# EAGLE design multisonar_shield (EAGLE 9.6.0)
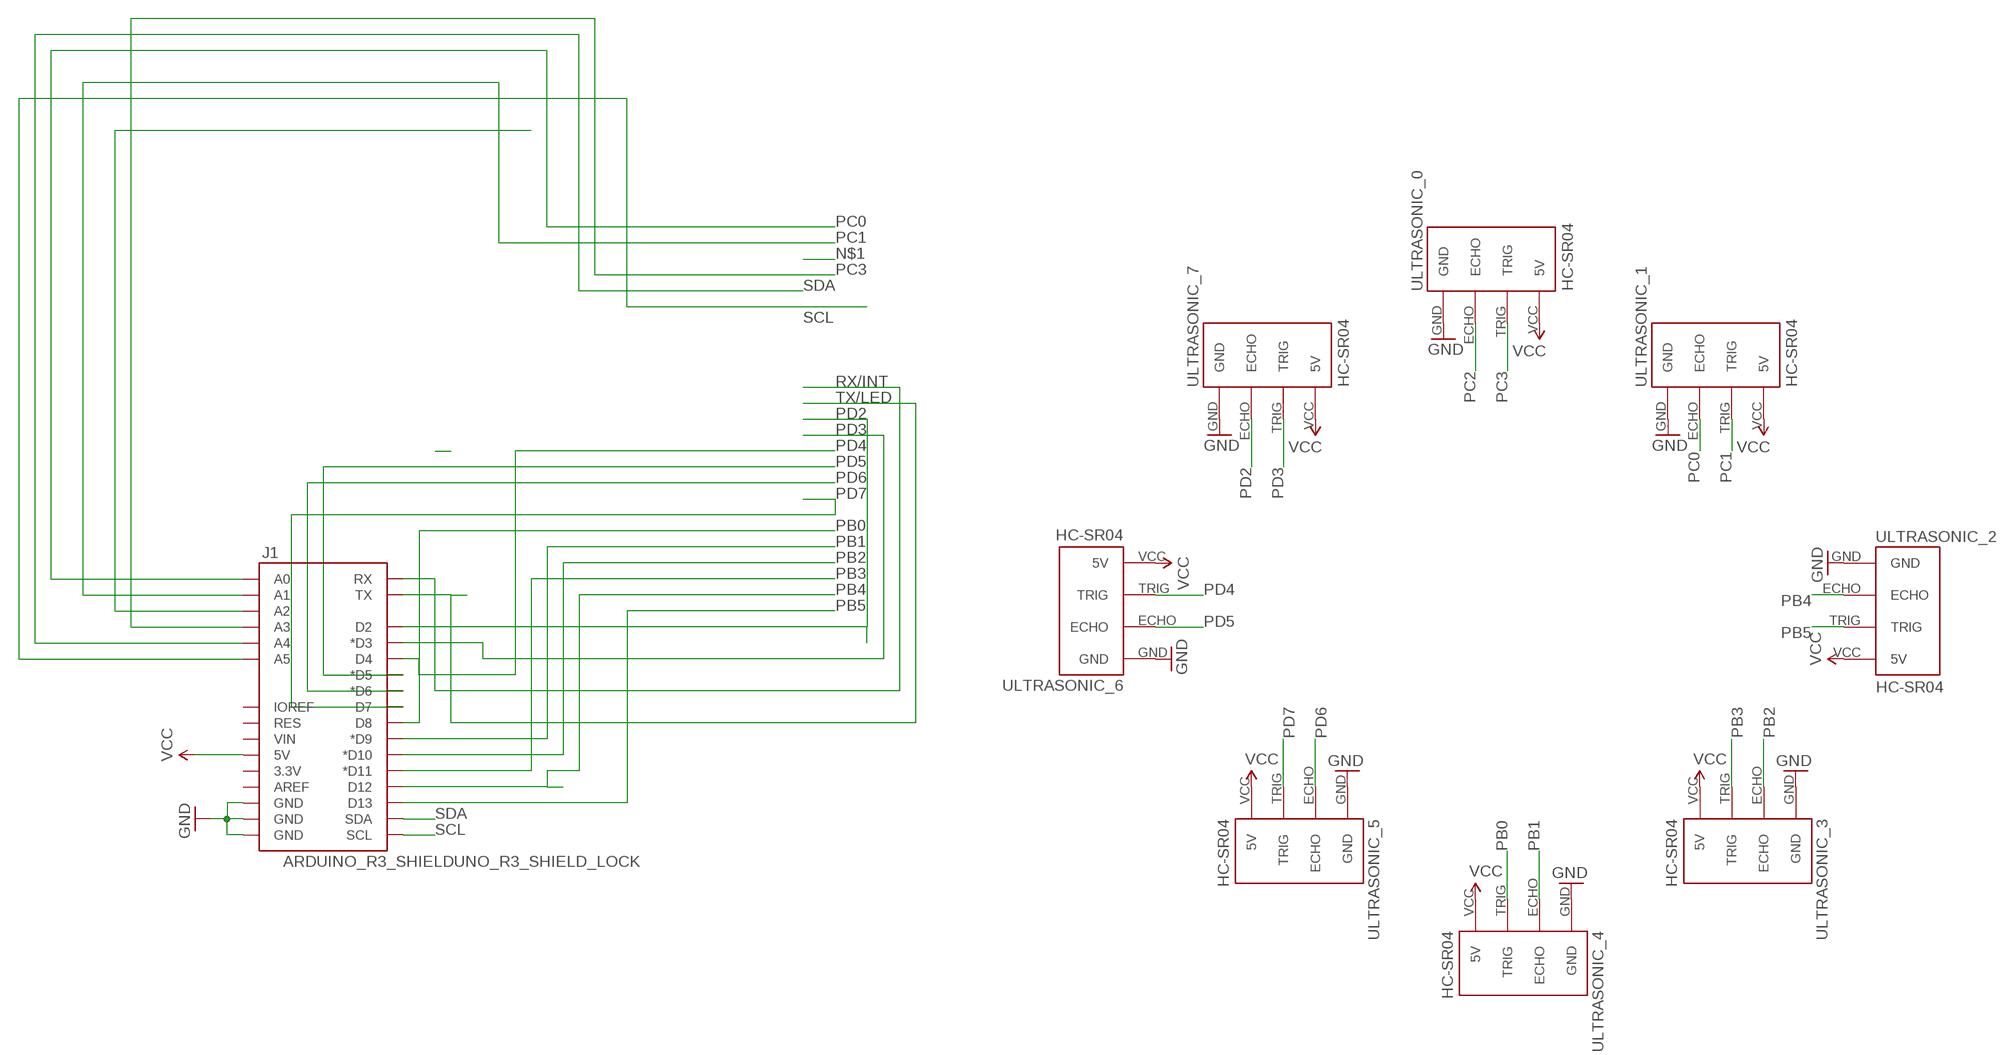
[diagram p0: schematic, sheet 1]

## Parts
J1  ARDUINO_R3_SHIELDUNO_R3_SHIELD_LOCK  [UNO_R3_SHIELD_LOCK]
ULTRASONIC_0  HC-SR04  [HC-SR04_FOOTPRINT]
ULTRASONIC_1  HC-SR04  [HC-SR04_FOOTPRINT]
ULTRASONIC_2  HC-SR04  [HC-SR04_FOOTPRINT]
ULTRASONIC_3  HC-SR04  [HC-SR04_FOOTPRINT]
ULTRASONIC_4  HC-SR04  [HC-SR04_FOOTPRINT]
ULTRASONIC_5  HC-SR04  [HC-SR04_FOOTPRINT]
ULTRASONIC_6  HC-SR04  [HC-SR04_FOOTPRINT]
ULTRASONIC_7  HC-SR04  [HC-SR04_FOOTPRINT]

## Nets
GND: J1.GND@0(GND) J1.GND@1(GND) J1.GND@2(GND) ULTRASONIC_0.GND ULTRASONIC_1.GND ULTRASONIC_2.GND ULTRASONIC_3.GND ULTRASONIC_4.GND ULTRASONIC_5.GND ULTRASONIC_6.GND ULTRASONIC_7.GND
PB0: J1.D8 ULTRASONIC_4.TRIG
PB1: J1.D9(*D9) ULTRASONIC_4.ECHO
PB2: J1.D10(*D10) ULTRASONIC_3.ECHO
PB3: J1.D11(*D11) ULTRASONIC_3.TRIG
PB4: J1.D12 ULTRASONIC_2.ECHO
PB5: J1.D13 ULTRASONIC_2.TRIG
PC0: J1.A0 ULTRASONIC_1.ECHO
PC1: J1.A1 ULTRASONIC_1.TRIG
PC2: J1.A2 ULTRASONIC_0.ECHO
PC3: J1.A3 ULTRASONIC_0.TRIG
PD2: J1.D2 ULTRASONIC_7.ECHO
PD3: J1.D3(*D3) ULTRASONIC_7.TRIG
PD4: J1.D4 ULTRASONIC_6.TRIG
PD5: J1.D5(*D5) ULTRASONIC_6.ECHO
PD6: J1.D6(*D6) ULTRASONIC_5.ECHO
PD7: J1.D7 ULTRASONIC_5.TRIG
RX/INT: J1.RX
SCL: J1.A5 J1.SCL
SDA: J1.A4 J1.SDA
TX/LED: J1.TX
VCC: J1.5V ULTRASONIC_0.VCC(5V) ULTRASONIC_1.VCC(5V) ULTRASONIC_2.VCC(5V) ULTRASONIC_3.VCC(5V) ULTRASONIC_4.VCC(5V) ULTRASONIC_5.VCC(5V) ULTRASONIC_6.VCC(5V) ULTRASONIC_7.VCC(5V)
Unconnected: J1.3.3V J1.AREF J1.IOREF J1.RES J1.VIN

## Library data of the parts
J1 = SparkFun-Boards:ARDUINO_R3_SHIELD: Shield form compatible with the Arduino Uno R3.
ULTRASONIC_0 ULTRASONIC_1-ULTRASONIC_7 = Ultrasonic Sensor HC-SR04:HC-SR04: Ultrasonic Sensor HC-SR04

## Board
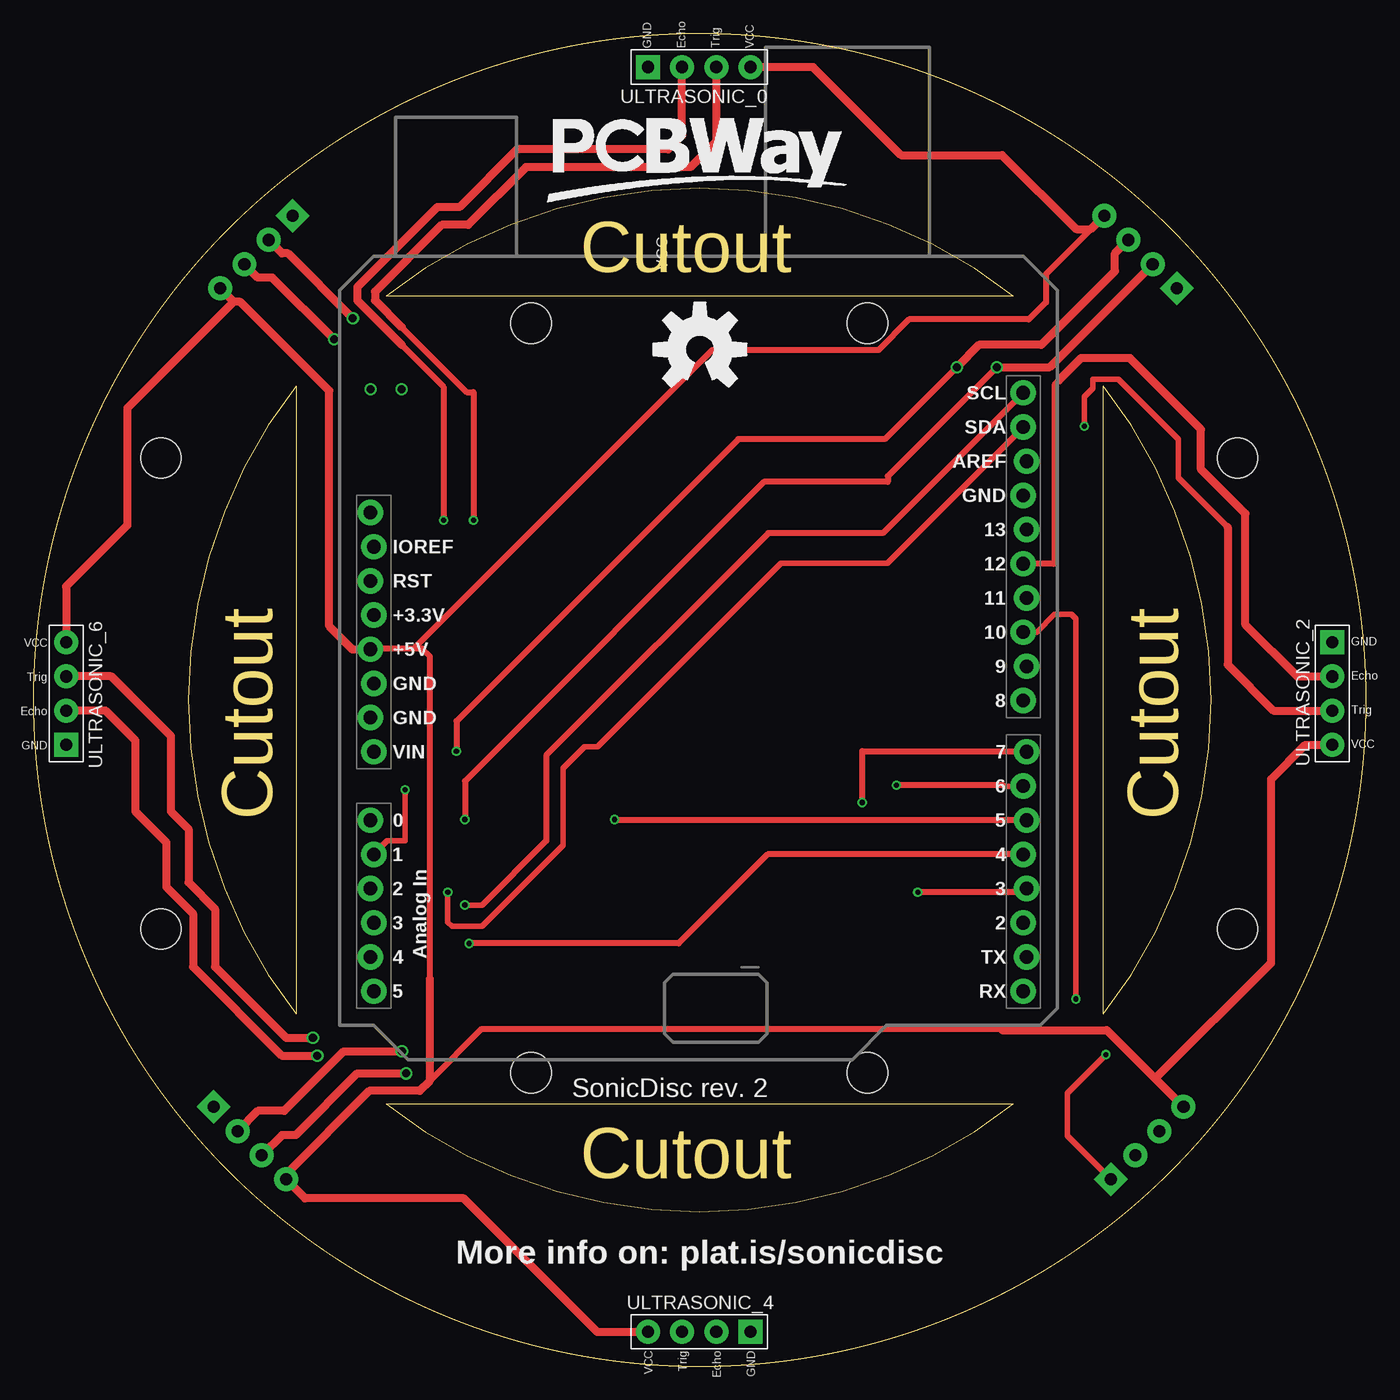
[diagram p1: board, top side]
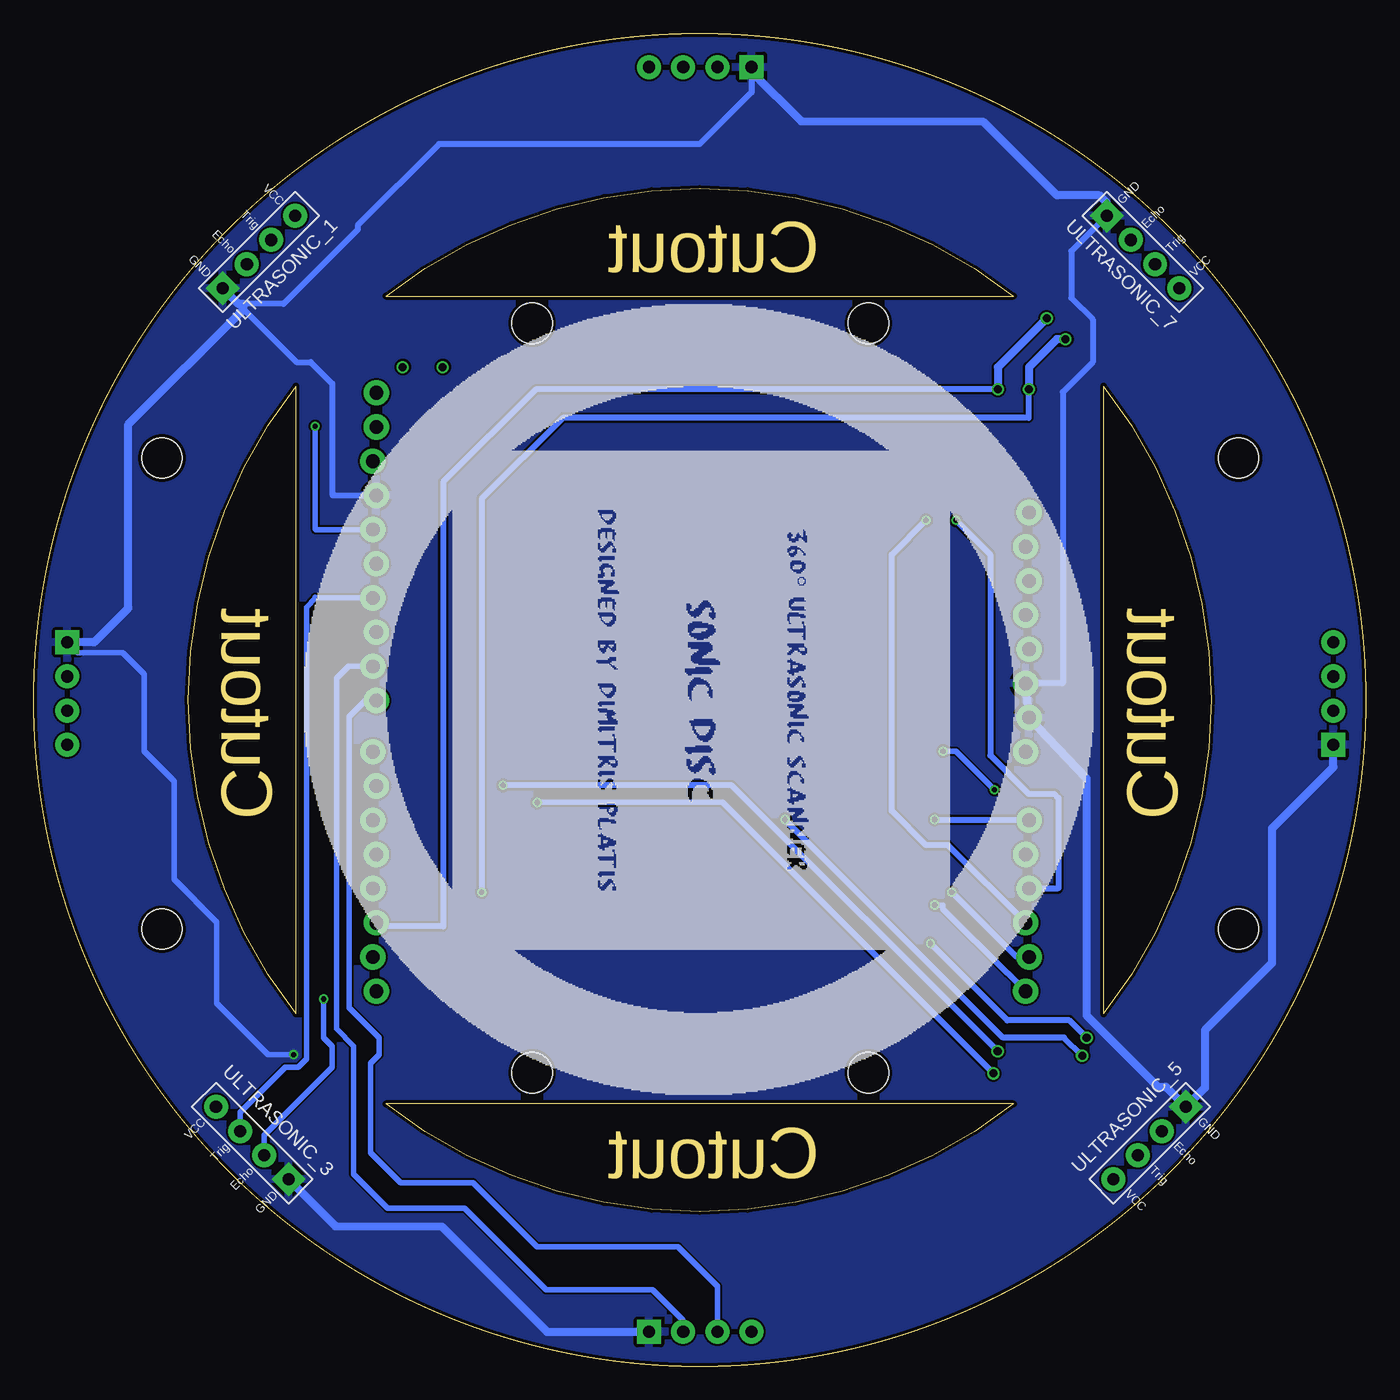
[diagram p2: board, bottom side, seen from below]

Size 99 x 99 mm. Coordinates in mm from the lower left corner, seen from the top.
Outline: 19.5,72.82 arc76 19.5,26.18 19.5,72.82
Outline: 26.18,19.5 72.82,19.5 arc-76 26.18,19.5
Outline: 79.5,26.18 79.5,72.82 arc-76 79.5,26.18
Outline: 72.82,79.5 arc76 26.18,79.5 72.82,79.5
Outline: circle at 49.5,49.5 radius 49.5
Copper layers (1*16): Top 0.035mm / dielectric 1.5mm / Bottom 0.035mm
Design rules "SeeedStudio_2layer_DRU_edited": minimum track width 7mil, minimum drill 15mil, track to track 6mil, track to pad 6mil, pad to pad 6mil, via to via 6mil, smd to smd 0mil, copper to edge 10mil, drill to drill 10mil, minimum pad ring 10mil, minimum via ring 6mil, stop-mask expansion 2mil, vias tented up to drill 100mil, thermal gap 10mil
Holes 3 mm at 36.96,77.48 36.96,21.81 61.96,21.81 61.96,77.48 9.46,32.48 89.46,32.48 89.46,67.48 9.46,67.48
Milling: 8 lines

### Footprints (pad centres in the part's own frame; a part is rotated, then mirrored left to right if it is on the bottom)
UNO_R3_SHIELD_LOCK = drill 1.016 pad 1.88: 3.3V 50.8,26.67; 5V 51.054,29.21; A0 51.054,41.91; A1 50.8,44.45; A2 51.054,46.99; A3 50.8,49.53; A4 51.054,52.07; A5 50.8,54.61; AREF 2.286,15.24; D2 2.54,49.53; D3 2.286,46.99; D4 2.54,44.45; D5 2.286,41.91; D6 2.54,39.37; D7 2.286,36.83; D8 2.54,33.02; D9 2.286,30.48; D10 2.54,27.94; D11 2.286,25.4; D12 2.54,22.86; D13 2.286,20.32; GND@0 50.8,31.75; GND@1 51.054,34.29; GND@2 2.54,17.78; IOREF 50.8,21.59; NC 51.054,19.05; RES 51.054,24.13; RX 2.54,54.61; SCL 2.54,10.16; SDA 2.54,12.7; TX 2.286,52.07; VIN 50.8,36.83
HC-SR04_FOOTPRINT = drill 0.9 pad 1.778: ECHO 2.54,1.27; TRIG 2.54,-1.27; VCC 2.54,-3.81 | drill 0.9 pad 1.778 square: GND 2.54,3.81

### Placement (x,y rotation side)
J1  76.08,82.48 180 top
U$1  [OSHW-LOGO-L]  49.51,75.54 0 top
ULTRASONIC_0  49.46,93.98 90 top
ULTRASONIC_1  80.46,80.98 135 bottom
ULTRASONIC_2  93.96,49.98 0 top
ULTRASONIC_3  80.96,18.38 225 bottom
ULTRASONIC_4  49.46,5.1 270 top
ULTRASONIC_5  17.86,18.38 315 bottom
ULTRASONIC_6  4.96,49.98 180 top
ULTRASONIC_7  18.36,80.98 45 bottom

### Tracks (layer width: path | path; a pad name or v marks a point on that pad's centre or on a via)
GND  (via drill 0.38)
  Top 0.406: ULTRASONIC_3.GND 76.81,17.13 76.81,20.3 v79.67,23.16
  Bottom 0.406: ULTRASONIC_2.GND 95.71,53 92.37,53 90.78,51.41 90.78,45.7 88.56,43.48 88.56,36.17 85.39,33 85.39,26.97 81.58,23.16 v79.67,23.16
  Bottom 0.457: ULTRASONIC_0.GND 45.65,94.65 49.51,90.78 68.88,90.78 74.91,84.75 74.91,84.44 80.42,78.92 83.79,78.92 | ULTRASONIC_1.GND 79.46,74.59 78.4,74.59 76.81,73 76.81,64.75 76.77,64.7 J1.GND@2 | ULTRASONIC_7.GND 21.88,82.85 21.89,82.85 21.89,79.35 20.3,77.77 20.3,74.59 22.52,72.37 22.52,50.78 22.57,50.73 J1.GND@0
  Bottom 0.61: J1.GND@2 73.82,64.98 | J1.GND@0 J1.GND@1 20.75,43.66 20.75,26.05 15.47,20.77 14.87,20.77 ULTRASONIC_5.GND 11.96,20.68 11.96,24.98 6.96,29.98 6.96,39.98 2.42,44.52 ULTRASONIC_6.GND | ULTRASONIC_0.GND 45.65,96.17 41.96,92.48 28.46,92.48 22.96,86.98 19.79,86.98 | ULTRASONIC_4.GND 60.85,2.56 68.68,10.39 76.57,10.39 ULTRASONIC_3.GND 80.06,14.38 | ULTRASONIC_2.GND 94.5,53.79 91.96,56.33 91.96,69.98 83.4,78.54 83.4,78.92 83.79,78.92 ULTRASONIC_1.GND | 18.75,85.47 ULTRASONIC_7.GND 19.25,86.44 19.79,86.98 | 19.79,86.98 19.76,86.98
  pour Bottom: -0.54,99.98 99.46,99.98 99.46,-1.02 -0.54,-1.02
PB0
  Bottom 0.406: ULTRASONIC_4.TRIG 48.19,5.96 51.1,8.87 61.57,8.87 66.34,13.63 71.73,13.63 73.96,15.85 73.96,22.52 73.32,23.16 73.32,24.43 75.54,26.65 75.54,48.24 74.27,49.51 73.59,49.51 J1.D8
PB1
  Bottom 0.406: J1.D9 75.59,52 76.5,51.1 76.5,25.06 75.23,23.79 75.23,14.27 72.69,11.73 66.97,11.73 60.94,5.69 53,5.69 50.73,3.42 ULTRASONIC_4.ECHO
PB2  (via drill 0.38)
  Top 0.406: J1.D10 74.54,54.54 75.86,55.86 77.13,55.86 77.45,55.54 v77.45,27.28
  Bottom 0.406: v77.45,27.28 77.45,24.43 76.81,23.79 76.81,22.2 81.86,17.16 ULTRASONIC_3.ECHO
PB3
  Bottom 0.406: J1.D11 78.03,57.08 | 78.03,57.08 78.08,57.13 | 78.03,57.08 78.72,56.39 78.72,22.84 79.35,22.2 80.31,22.2 83.65,18.86 ULTRASONIC_3.TRIG
PB4
  Top 0.457: 76.19,73.24 75.86,72.91 75.86,59.67 75.81,59.62 J1.D12
  Top 0.61: 76.19,73.24 77.84,74.89 81.47,74.89 86.75,69.61 86.75,66.64 90.05,63.34 90.05,55.09 93.89,51.25 ULTRASONIC_2.ECHO
PB5  (via drill 0.38)
  Top 0.406: v78.08,69.83 78.08,72.02 78.72,72.65 78.72,73.32 80.62,73.32 85.07,68.88 85.07,66.01 88.73,62.35
  Top 0.61: 88.73,62.35 88.73,52.12 92.14,48.71 ULTRASONIC_2.TRIG
  Bottom 0.406: J1.D13 78.03,62.16 78.08,62.21 v78.08,69.83
PC0  (via drill 0.38, 0.6)
  Top 0.457: v71.57,74.23 63.48,66.14 63.48,65.7 54.27,65.7 32.05,43.48 v32.05,40.62
  Top 0.61: v71.57,74.23 75.51,74.23 ULTRASONIC_1.ECHO
  Bottom 0.457: v32.05,40.62 25.08,40.62 J1.A0
PC1  (via drill 0.38, 0.6)
  Top 0.406: J1.A1 26.28,39.03 27.6,39.03 v27.6,42.84
  Top 0.457: v68.6,74.23 63.25,68.88 52.37,68.88 31.41,47.92 v31.41,45.7
  Top 0.61: v68.6,74.23 70.25,75.88 74.87,75.88 80.36,81.37 80.36,82.67 ULTRASONIC_1.TRIG
  Bottom 0.406: v27.6,42.84 30.46,45.7 v31.41,45.7
PC2  (via drill 0.38)
  Top 0.457: 27.35,75.88 30.46,72.77 v30.46,62.84
  Top 0.61: 27.35,75.88 24.05,79.18 24.05,80.17 29.99,86.11 31.64,86.11 35.93,90.4 47.15,90.4 48.19,91.44 ULTRASONIC_0.ECHO
  Bottom 0.457: v30.46,62.84 27.92,60.3 27.92,45.38 25.06,42.52 23.16,42.52 22.84,42.21 22.84,35.54 22.89,35.49 J1.A2
PC3  (via drill 0.38)
  Top 0.457: 27.35,77.2 32.18,72.37 32.68,72.37 v32.68,62.84
  Top 0.61: 27.35,77.2 25.37,79.18 25.37,79.84 30.32,84.79 32.3,84.79 36.59,89.08 48.8,89.08 50.73,91.01 ULTRASONIC_0.TRIG
  Bottom 0.457: J1.A3 31.04,38.71 32.68,38.71 35.22,41.25 35.22,60.3 v32.68,62.84
PD2  (via drill 0.6)
  Top 0.61: v23.72,77.86 18.91,82.67 18.46,82.67 ULTRASONIC_7.ECHO
  Bottom 0.457: v27.35,72.58 61.68,72.58 68.56,65.7 68.56,32.68 73.27,32.68 J1.D2
  Bottom 0.61: v23.72,77.86 27.35,74.23 v27.35,72.58
PD3  (via drill 0.38, 0.6)
  Top 0.457: J1.D3 73.53,35.22 v65.7,35.22
  Top 0.61: v22.32,76.3 17.74,80.88 16.66,80.88 ULTRASONIC_7.TRIG
  Bottom 0.457: v25.04,72.58 25.06,72.56 25.06,70.47 59.67,70.47 65.7,64.43 v65.7,35.22
  Bottom 0.61: v25.04,72.58 25.04,74.23 22.97,76.3 v22.32,76.3
PD4  (via drill 0.38, 0.6)
  Top 0.457: J1.D4 54.54,38.03 47.92,31.41 v32.36,31.41
  Top 0.61: v20.75,24.4 18.77,24.4 13.49,29.68 13.49,33.97 11.51,35.95 11.51,39.91 10.19,41.23 10.19,46.84 5.78,51.25 ULTRASONIC_6.TRIG
  Bottom 0.457: v20.75,24.4 22.05,25.7 26.65,25.7 v32.36,31.41
PD5  (via drill 0.38, 0.6)
  Top 0.457: v43.16,40.62 73.74,40.62 J1.D5
  Top 0.61: v21.08,23.08 18.44,23.08 11.84,29.68 11.84,33.64 9.86,35.62 9.86,38.92 7.55,41.23 7.55,46.51 5.35,48.71 ULTRASONIC_6.ECHO
  Bottom 0.457: v21.08,23.08 22.43,24.43 26.97,24.43 v43.16,40.62
PD6  (via drill 0.38, 0.6)
  Top 0.406: J1.D6 72.1,43.11 72.05,43.16
  Top 0.457: 72.05,43.16 v64.11,43.16
  Top 0.61: v27.36,23.4 23.05,23.4 18.63,18.98 16.66,18.98 ULTRASONIC_5.ECHO
  Bottom 0.457: v27.36,23.4 47.12,43.16 v64.11,43.16
PD7  (via drill 0.38, 0.6)
  Top 0.457: v61.57,41.89 61.57,45.7 73.74,45.7 J1.D7
  Top 0.61: v27.68,21.76 24.05,21.76 19.47,17.18 18.46,17.18 ULTRASONIC_5.TRIG
  Bottom 0.406: 47.81,41.89 v61.57,41.89
  Bottom 0.457: v27.68,21.76 47.81,41.89
SCL  (via drill 0.38)
  Top 0.406: 33.32,34.27 v32.05,34.27
  Top 0.457: J1.SCL 63.11,61.89 54.59,61.89 38.08,45.38 38.08,39.03 33.32,34.27
  Top 0.61: 73.38,72.48 J1.SCL
  Bottom 0.406: J1.A5 26.6,29.19 26.65,29.19 31.41,33.95 31.41,34.27 v32.05,34.27
SDA  (via drill 0.38)
  Top 0.406: J1.SDA 63.43,59.67 55.54,59.67 41.89,46.02 40.94,46.02 39.35,44.43 39.35,38.71 33.32,32.68 31.09,32.68 30.78,33 v30.78,35.22
  Top 0.61: 73.34,69.98 J1.SDA
  Bottom 0.406: J1.A4 25.96,30.41 v30.78,35.22
VCC
  Top 0.457: 29.46,28.79 29.46,52.73 28.87,53.32 28.24,53.32 | 28.24,53.32 25.33,53.32 25.28,53.27 | 29.46,21.23 33.29,25.06 71.97,25.06 72.05,24.98 | ULTRASONIC_1.VCC 75.23,81.14 75.23,79.04 73.96,77.77 65.05,77.77 62.78,75.5 50.41,75.5 28.24,53.32
  Top 0.61: 83.33,21.39 79.74,24.98 72.05,24.98 71.96,24.98 | 83.33,21.39 83.37,21.39 91.96,29.98 91.96,43.63 94.5,46.17 ULTRASONIC_2.VCC | 29.46,28.79 29.46,21.23 28.69,20.46 24.94,20.46 18.75,14.27 ULTRASONIC_5.VCC 20.16,12.48 31.96,12.48 41.88,2.56 ULTRASONIC_4.VCC | ULTRASONIC_0.VCC 57.92,96.52 64.46,89.98 71.96,89.98 77.47,84.47 78.56,84.47 ULTRASONIC_1.VCC | 83.33,21.39 ULTRASONIC_3.VCC | 14.87,79.08 15.36,79.08 21.96,72.48 21.96,54.98 23.67,53.27 J1.5V 25.28,53.27 | 14.87,79.08 6.96,71.18 6.96,62.48 2.42,57.94 ULTRASONIC_6.VCC | 14.87,79.08 ULTRASONIC_7.VCC

### Text on the board
Dimension: Cutout | Cutout | Cutout | Cutout
tPlace: VCC | SonicDisc rev. 2 | More info on: plat.is/sonicdisc